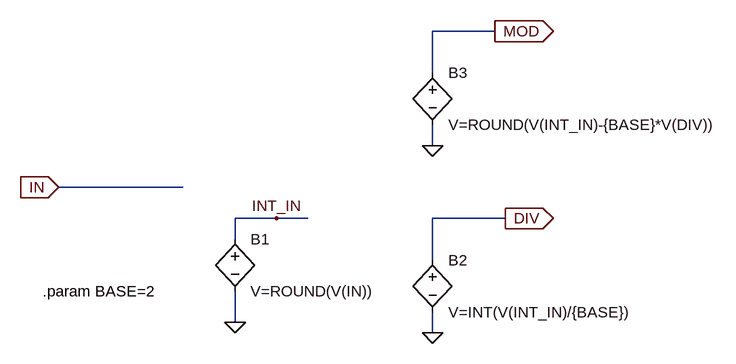
[diagram p0: schematic DivMod.asc]
DivMod.asc, the LTspice schematic file:
Version 4
SHEET 1 2360 1444
WIRE 944 -80 848 -80
WIRE 848 -16 848 -80
WIRE 848 96 848 64
WIRE 464 160 272 160
WIRE 608 208 544 208
WIRE 656 208 608 208
WIRE 960 208 848 208
WIRE 544 240 544 208
WIRE 848 272 848 208
WIRE 544 368 544 320
WIRE 848 384 848 352
FLAG 960 208 DIV
IOPIN 960 208 Out
FLAG 272 160 IN
IOPIN 272 160 In
FLAG 944 -80 MOD
IOPIN 944 -80 Out
FLAG 544 368 0
FLAG 608 208 INT_IN
FLAG 848 384 0
FLAG 848 96 0
SYMBOL bv 544 224 R0
SYMATTR InstName B1
SYMATTR Value V=ROUND(V(IN))
SYMBOL bv 848 256 R0
SYMATTR InstName B2
SYMATTR Value V=INT(V(INT_IN)/{BASE})
SYMBOL bv 848 -32 R0
SYMATTR InstName B3
SYMATTR Value V=ROUND(V(INT_IN)-{BASE}*V(DIV))
TEXT 248 320 Left 2 !.param BASE=2

The netlist it stands for:
* DivMod.asc
B1 INT_IN 0 V=ROUND(V(IN))
B2 DIV 0 V=INT(V(INT_IN)/{BASE})
B3 MOD 0 V=ROUND(V(INT_IN)-{BASE}*V(DIV))
.param BASE=2
.backanno
.end